# EAGLE design arm_4inProp (EAGLE 5.10)
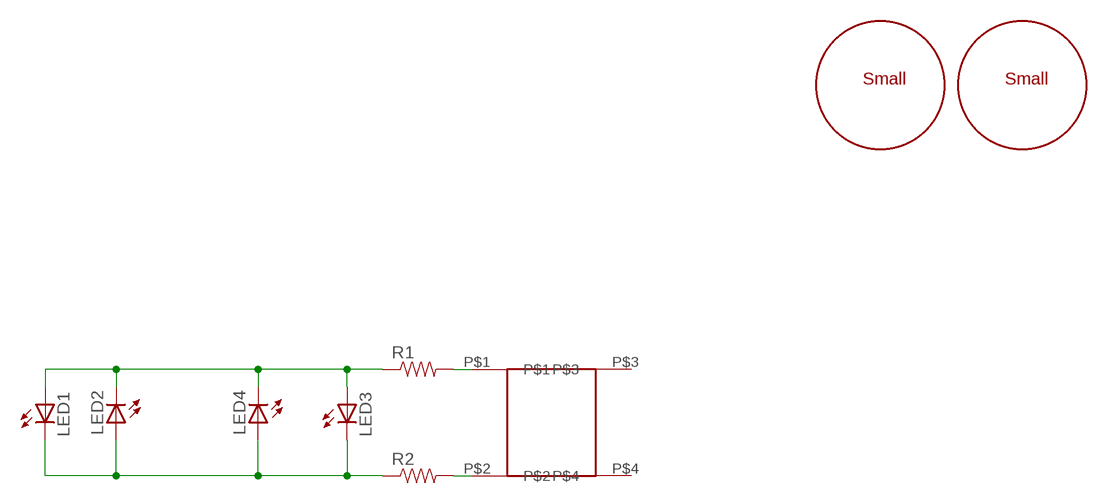
[diagram p0: schematic, sheet 1]

## Parts
LED1  LEDCHIP-LED0603  [CHIP-LED0603]
LED2  LEDCHIP-LED0603  [CHIP-LED0603]
LED3  LEDCHIP-LED0603  [CHIP-LED0603]
LED4  LEDCHIP-LED0603  [CHIP-LED0603]
R1  RESISTOR  [0805]
R2  RESISTOR  [0805]
U$1  SLOT  [SLOT]
U$2  SLOT_SM  [SLOT_SM]
U$3  SLOT_SM  [SLOT_SM]

## Nets
N$1: LED1.A LED2.C LED3.A LED4.C R1.1
N$4: LED1.C LED2.A LED3.C LED4.A R2.1
N$7: R1.2 U$1.P$1
N$8: R2.2 U$1.P$2
Unconnected: U$1.P$3 U$1.P$4

## Library data of the parts
LED1-LED4 = led:LED: LED OSRAM: - CHIPLED LG R971, LG N971, LY N971, LG Q971, LY Q971, LO R971, LY R971 LH N974, LH R974 LS Q976, LO Q976, LY Q976 LO Q996 - Hyper CHIPLED LW Q18S LB Q993, LB Q99A, LB R99A - SideLED LS A670, LO A670, LY A670, LG A670, LP A670 LB A673, LV A673, LT A673, LW A673 LH A674 LY A675 LS A676, LA A676, LO A676, LY A676, LW A676 LS A679, LY A679, LG A679 - Hyper Micro SIDELED® LS Y876, LA Y876, LO Y876, LY Y876 LT Y87S - SmartLED LW L88C, LW L88S LB L89C, LB L89S, LG L890 LS L89K, LO L89K, LY L89K LS L896, LA L896, LO L896, LY L896 - TOPLED LS T670, LO T670, LY T670, LG T670, LP T670 LSG T670, LSP T670, LSY T670, LOP T670, LYG T670 LG T671, LOG T671, LSG T671 LB T673, LV T673, LT T673, LW T673 LH T674 LS T676, LA T676, LO T676, LY T676, LB T676, LH T676, LSB T676, LW T676 LB T67C, LV T67C, LT T67C, LS T67K, LO T67K, LY T67K, LW E67C LS E67B, LA E67B, LO E67B, LY E67B, LB E67C, LV E67C, LT E67C LW T67C LS T679, LY T679, LG T679 LS T770, LO T770, LY T770, LG T770, LP T770 LB T773, LV T773, LT T773, LW T773 LH T774 LS E675, LA E675, LY E675, LS T675 LS T776, LA T776, LO T776, LY T776, LB T776 LHGB T686 LT T68C, LB T68C - Hyper Mini TOPLED® LB M676 - Mini TOPLED Santana® LG M470 LS M47K, LO M47K, LY M47K Source: http://www.osram.convergy.de LUXEON: - LUMILED® LXK2-PW12-R00, LXK2-PW12-S00, LXK2-PW14-U00, LXK2-PW14-V00 LXK2-PM12-R00, LXK2-PM12-S00, LXK2-PM14-U00 LXK2-PE12-Q00, LXK2-PE12-R00, LXK2-PE12-S00, LXK2-PE14-T00, LXK2-PE14-U00 LXK2-PB12-K00, LXK2-PB12-L00, LXK2-PB12-M00, LXK2-PB14-N00, LXK2-PB14-P00, LXK2-PB14-Q00 LXK2-PR12-L00, LXK2-PR12-M00, LXK2-PR14-Q00, LXK2-PR14-R00 LXK2-PD12-Q00, LXK2-PD12-R00, LXK2-PD12-S00 LXK2-PH12-R00, LXK2-PH12-S00 LXK2-PL12-P00, LXK2-PL12-Q00, LXK2-PL12-R00 Source: www.luxeon.com KINGBRIGHT: KA-3528ASYC Source: www.kingbright.com
R1 R2 = SparkFun:RESISTOR: Resistor Basic schematic elements and footprints for 0603, 1206, and PTH 1/10th watt (small) resistors.
U$1 = NSL_MiniQuad:SLOT
U$2 U$3 = arm_4inProp:SLOT_SM

## Board
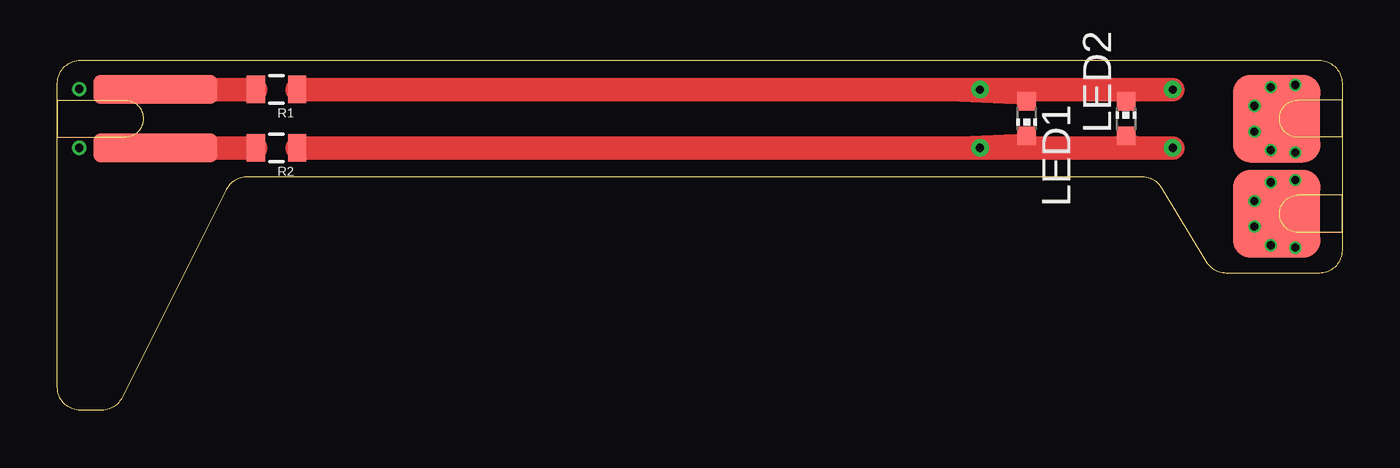
[diagram p1: board, top side]
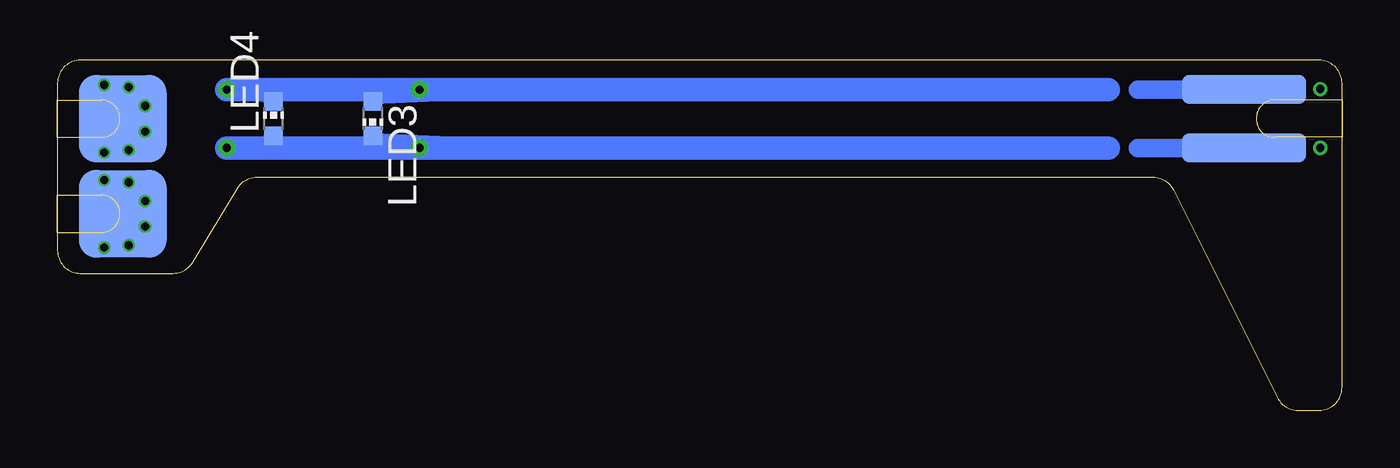
[diagram p2: board, bottom side, seen from below]

Size 55.88 x 15.24 mm. Coordinates in mm from the lower left corner, seen from the top.
Outline: 2.81,0.57 arc-65 1.91,0 1,0 arc-90 0,1 0,14.24 arc-90 1,15.24 54.88,15.24 arc-90 55.88,14.24 55.88,6.97 arc-90 54.88,5.97 50.85,5.97 arc-59 50,6.45 48.04,9.68 arc59 47.19,10.16 8.24,10.16 arc63 7.34,9.61 2.81,0.57
Copper layers (1*16): Top 0.0356mm / dielectric 1.5011mm / Bottom 0.0356mm
Design rules "SilverCircuits-tented": minimum track width 7mil, minimum drill 14mil, track to track 7mil, track to pad 7mil, pad to pad 7mil, via to via 7mil, smd to smd 0mil, copper to edge 20mil, drill to drill 8mil, minimum pad ring 0mil, minimum via ring 8mil, stop-mask expansion 4mil, vias tented up to drill 14mil, thermal gap 10mil

### Footprints (pad centres in the part's own frame; a part is rotated, then mirrored left to right if it is on the bottom)
CHIP-LED0603 = smd 0.8 x 0.8: A 0,-0.75; C 0,0.75
0805 = smd 0.8 x 1.2: 1 -0.9,0; 2 0.9,0
SLOT = smd 5.385 x 1.27: P$1 4.267,1.27; P$2 4.267,-1.27 | smd 5.385 x 1.27 bottom: P$3 4.267,1.27; P$4 4.267,-1.27 | drill 0.356 pad 0.61 round: P$5 0.94,1.295; P$6 0.94,-1.27
SLOT_SM = smd 3.81 x 3.81 bottom: K 2.845,0 | drill 0.356 round: N 2.032,1.473; O 3.099,1.372; P 3.81,0.559; R 2.032,-1.473; S 3.099,-1.372; T 3.81,-0.559 | smd 3.81 x 3.81: P$1 2.845,0

### Placement (x,y rotation side)
LED1  42.16,12.7 180 top
LED2  46.48,12.7 0 top
LED3  42.16,12.7 180 bottom
LED4  46.48,12.7 0 bottom
R1  9.53,13.97 180 top
R2  9.53,11.43 180 top
U$1  0,12.7 0 top
U$2  55.88,12.7 180 top
U$3  55.88,8.56 180 top

### Tracks (layer width: path | path; a pad name or v marks a point on that pad's centre or on a via)
N$1  (via drill 0.36)
  Top 0.254: LED1.A 30.48,13.97 v40.13,13.97 v48.51,13.97 LED2.C
  Top 1.016: R1.1 v48.51,13.97
  Bottom 0.254: LED1.A 30.48,13.97 v40.13,13.97 v48.51,13.97 LED2.C
  Bottom 1.016: v48.51,13.97 10.16,13.97
N$2
  Bottom 0.813: 6.1,13.97 8.89,13.97
N$3
  Bottom 0.813: 2.54,11.43 8.89,11.43
N$4  (via drill 0.36)
  Top 0.254: LED1.C 30.48,11.43 v40.13,11.43 v48.51,11.43 LED2.A
  Top 1.016: R2.1 v48.51,11.43
  Bottom 0.254: v48.51,11.43 LED2.A | v40.13,11.43 30.48,11.43 LED1.C
  Bottom 1.016: 10.16,11.43 v40.13,11.43 v48.51,11.43
N$7
  Top 1.016: U$1.P$1 R1.2
N$8
  Top 1.016: U$1.P$2 R2.2